# Altium project smartControllerDIP.PRJPCB
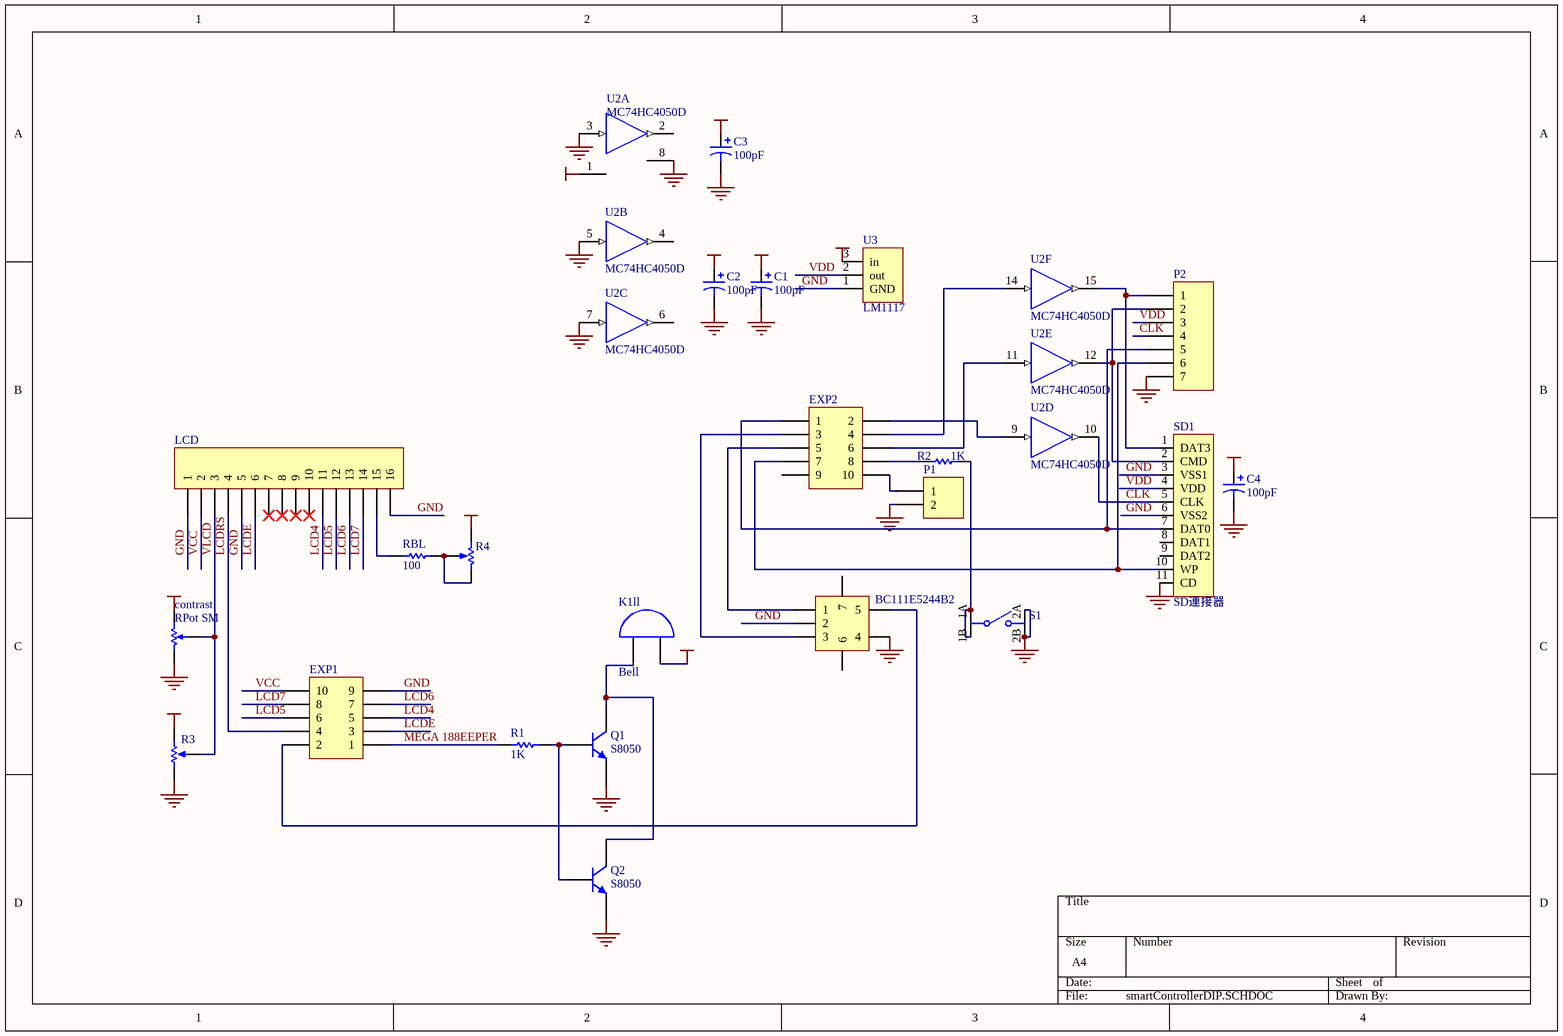
[diagram p0: smartControllerDIP.SCHDOC]
1 sheet, 23 parts. Net scope: global (net labels, ports and power ports of the same name join across sheets).
Board file: smartControllerDIP.PCBDOC

## Sheet smartControllerDIP.SCHDOC
size A4

### Parts
BC111E5244B2  上下數 編碼器  [上下數 編碼器]  (value not drawn)
C1  value 100pF  [CC2012-0805]  (hidden comment: Cap Pol3)
C2  value 100pF  [CC2012-0805]  (hidden comment: Cap Pol3)
C3  value 100pF  [CC2012-0805]  (hidden comment: Cap Pol3)
C4  value 100pF  [CC2012-0805]  (hidden comment: Cap Pol3)
contrast  RPot SM  [POT4MM-2]
EXP1  Header 5X2  [10pin牛角公座]  (value not drawn)
EXP2  Header 5X2  [10pin牛角公座]  (value not drawn)
K1ll  Bell  [speaker]
LCD  Header 16  [HDR1X16]  (value not drawn)
P1  Header 2  [HDR1X2]  (value not drawn)
P2  Header 7  [HDR1X7]  (value not drawn)
Q1  S8050  [sot-23]
Q2  S8050  [A684]
R1  value 1K  [0805]  (hidden comment: Res1)
R2  value 1K  [0805]  (hidden comment: Res1)
R3  VR1  [VR1]  (value not drawn)
R4  VR1  [VR1]  (value not drawn)
RBL  value 100  [0805]  (hidden comment: Res1)
S1  SW DIP4  [SW DIP4]  (value not drawn)
SD1  SD連接器  [SD-4]
U2  MC74HC4050D  [751B-03]  (parts A,B,C,D,E,F of 6)
U3  LM1117  [SOT-223]

### Nets
GND: BC111E5244B2.2 BC111E5244B2.4 C1.2 C2.2 C3.2 C4.2 contrast.CW(+) EXP1.9 LCD.1 LCD.5 LCD.16 P1.2 P2.7 Q1.2(E) Q2.1(E) R3.1(TOP) S1.2A S1.2B SD1.3(VSS1) SD1.6(VSS2) SD1.11(CD) U2.3(A) U2.5(A) U2.7(A) U2.8(GND) U3.1(GND)
VCC: C1.1 contrast.CCW(-) EXP1.10 K1ll.2(B) LCD.2 R3.3(BOT) R4.3(BOT) U3.3(in)
VDD: C2.1 C3.1 C4.1 P2.3 SD1.4(VDD) U2.1(VDD) U3.2(out)
CLK: P2.4 SD1.5(CLK) U2.10(Y)
LCD4: EXP1.5 LCD.11
LCD5: EXP1.6 LCD.12
LCD6: EXP1.7 LCD.13
LCD7: EXP1.8 LCD.14
LCDE: EXP1.3 LCD.6
LCDRS: EXP1.4 LCD.4
MEGA 188EEPER: EXP1.1 R1.1
VLCD: contrast.W LCD.3 R3.2(TAP)
NetBC111E5244B2_1: BC111E5244B2.1 EXP2.5
NetBC111E5244B2_3: BC111E5244B2.3 EXP2.3
NetBC111E5244B2_5: BC111E5244B2.5 EXP1.2
NetEXP2_1: EXP2.1 P2.5 SD1.7(DAT0)
NetEXP2_2: EXP2.2 U2.9(A)
NetEXP2_4: EXP2.4 U2.14(A)
NetEXP2_6: EXP2.6 U2.11(A)
NetEXP2_7: EXP2.7 P2.6 SD1.10(WP)
NetEXP2_8: EXP2.8 R2.1
NetEXP2_10: EXP2.10 P1.1
NetK1ll_1: K1ll.1(A) Q1.3(C) Q2.2(C)
NetLCD_15: LCD.15 RBL.1
NetP2_1: P2.1 SD1.1(DAT3) U2.15(Y)
NetP2_2: P2.2 SD1.2(CMD) U2.12(Y)
NetQ1_1: Q1.1(B) Q2.3(B) R1.2
NetR2_2: R2.2 S1.1A S1.1B
NetR4_1: R4.1(TOP) R4.2(TAP) RBL.2

Not connected (* = marked no-connect by the designer): BC111E5244B2 6 7; EXP2 9; LCD 7* 8* 9* 10*; SD1 8(DAT1) 9(DAT2); U2 2(Y) 4(Y) 6(Y)

### Library data of the parts
C1-C4 = Cap Pol3: Polarized Capacitor (Surface Mount); Published: 8-Jun-2000; LatestRevisionDate: 17-Jul-2002; LatestRevisionNote: Re-released for DXP Platform.; PackageReference: C0805; Publisher: Altium Limited
contrast = RPot SM: Square Trimming Potentiometer; Published: 17-Dec-2003; DatasheetDocument: Oct-2003; Publisher: Altium Limited
EXP1 EXP2 = Header 5X2: Header, 5-Pin, Dual row; LatestRevisionDate: 17-Jul-2002; LatestRevisionNote: Re-released for DXP Platform.; Publisher: Altium Limited
K1ll = Bell: Electrical Bell; Published: 24-Mar-1999; LatestRevisionDate: 17-Jul-2002; LatestRevisionNote: Re-released for DXP Platform.; Publisher: Altium Limited
LCD = Header 16: Header, 16-Pin; LatestRevisionDate: 17-Jul-2002; LatestRevisionNote: Re-released for DXP Platform.; Publisher: Altium Limited
P1 = Header 2: Header, 2-Pin; LatestRevisionDate: 17-Jul-2002; LatestRevisionNote: Re-released for DXP Platform.; Publisher: Altium Limited
P2 = Header 7: Header, 7-Pin; LatestRevisionDate: 17-Jul-2002; LatestRevisionNote: Re-released for DXP Platform.; Publisher: Altium Limited
Q2 = A684
R1 R2 RBL = Res1: Resistor; Published: 8-Jun-2000; LatestRevisionDate: 17-Jul-2002; LatestRevisionNote: Re-released for DXP Platform.; Publisher: Altium Limited
R3 R4 = VR1: Potentiometer; Set Position: 0.5; Published: 8-Jun-2000; Revision: July-2002: Re-released for DXP Platform.; Publisher: Altium Limited
S1 = SW DIP4: Single-Pole, Single-Throw Switch; Published: 24-Mar-1999; Revision: July-2002: Re-released for DXP Platform.; Publisher: Altium Limited
U2 = MC74HC4050D: Hex Non-Inverting Buffer/Logic-Level Down Converter; PackageDocument: 1991; Note: Pins 13 & 16 are NC and not drawn.; Published: 17-Jul-2002; DatasheetDocument: 1989; PackageReference: 751B-03; Publisher: Altium Limited; Code_JEDEC: MS-012-AC; Code_IPC: SO16